# Altium schematic sheet TPS54560_5V.SchDoc
size A4; SheetNumber: 4; SheetTotal: 4
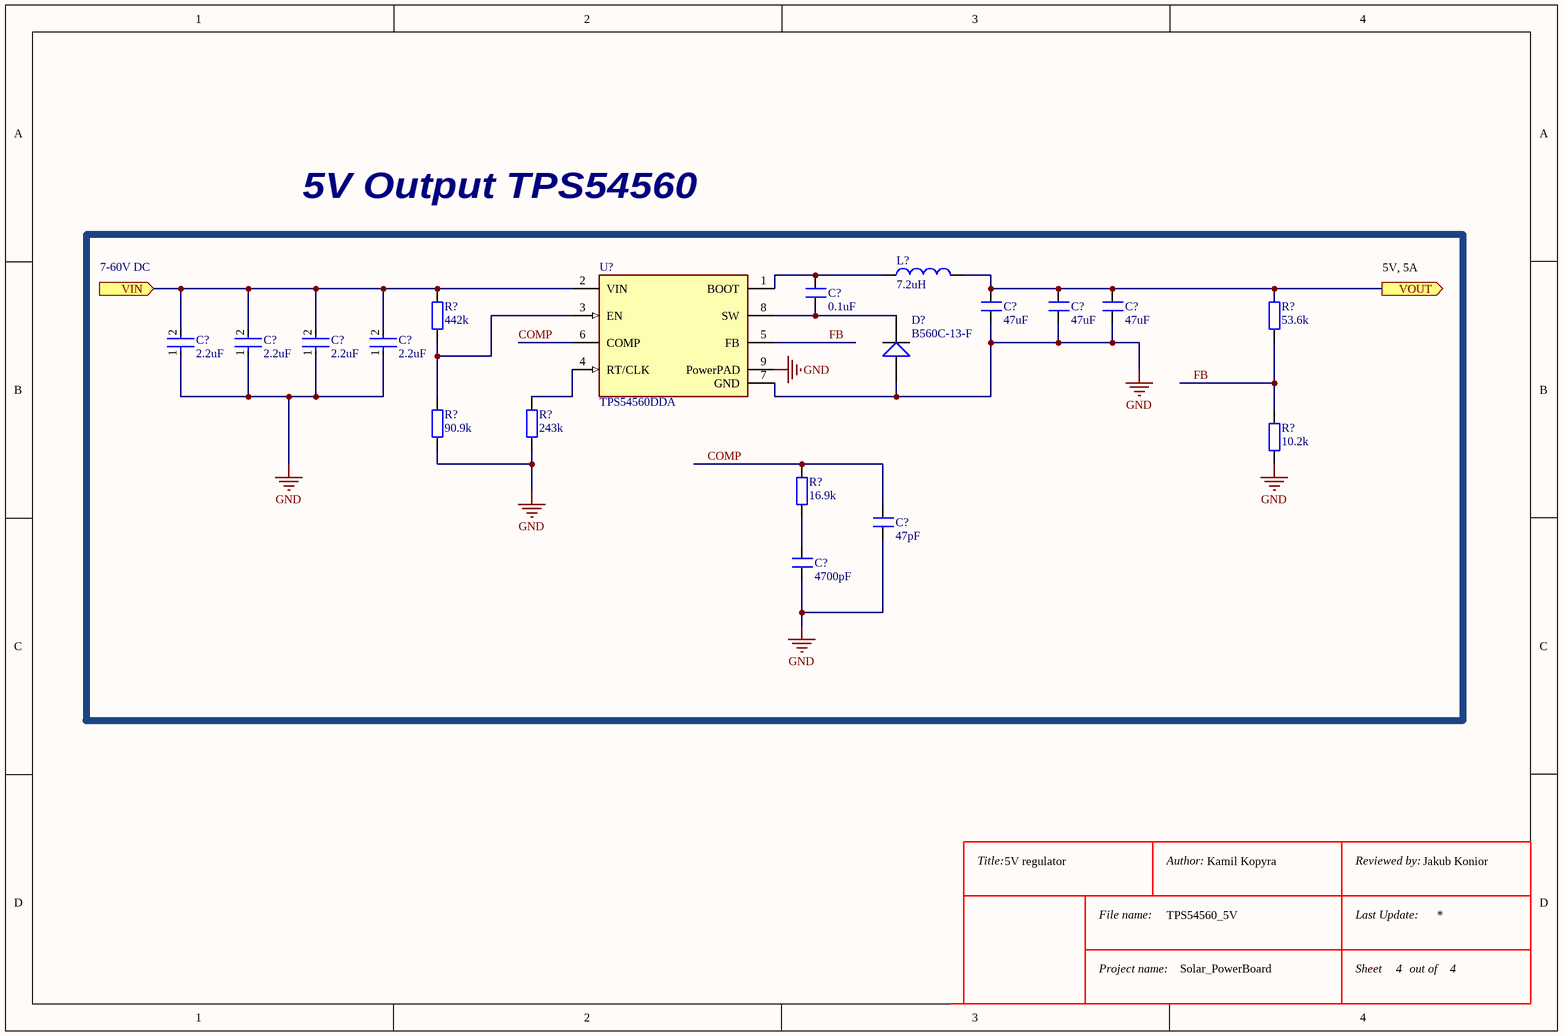
[diagram p0: TPS54560_5V.SchDoc]

## Parts
(Parts that share a designator on the sheet are numbered #1, #2 ... from top to bottom, then left to right.)
C?#1  0.1uF
C?#2  47uF
C?#3  47uF
C?#4  47uF
C?#5  2.2uF  [FP-GRM21B-0_2-e0_2_0_7-IPC_B]
C?#6  2.2uF  [FP-GRM21B-0_2-e0_2_0_7-IPC_B]
C?#7  2.2uF  [FP-GRM21B-0_2-e0_2_0_7-IPC_B]
C?#8  2.2uF  [FP-GRM21B-0_2-e0_2_0_7-IPC_B]
C?#9  47pF
C?#10  4700pF
D?  B560C-13-F
L?  7.2uH
R?#1  442k
R?#2  53.6k
R?#3  90.9k
R?#4  243k
R?#5  10.2k
R?#6  16.9k
U?  TPS54560DDA  [FP-DDA0008E-MFG]

## Blocks framed on the sheet
7-60V DC: C?#1-C?#10 D? L? R?#1-R?#6 U?

## Ports
VIN (in), VOUT (out)

## Nets
GND: C?#2.1 C?#3.1 C?#4.1 C?#5.1 C?#6.1 C?#7.1 C?#8.1 C?#9.1 C?#10.1 D?.6 R?#3.1 R?#4.1 R?#5.1 U?.7(GND) U?.9(PowerPAD)
COMP: C?#9.2 R?#6.2 U?.6(COMP)
FB: R?#2.1 R?#5.2 U?.5(FB)
VIN: C?#5.2 C?#6.2 C?#7.2 C?#8.2 R?#1.2 U?.2(VIN) ; port VIN
VOUT: C?#2.2 C?#3.2 C?#4.2 L?.8 R?#2.2 ; port VOUT
NetC?#1_1: C?#1.1 D?.5 U?.8(SW)
NetC?#1_2: C?#1.2 L?.7 U?.1(BOOT)
NetC?#10_2: C?#10.2 R?#6.1
NetR?#1_1: R?#1.1 R?#3.2 U?.3(EN)
NetR?#4_2: R?#4.2 U?.4(RT/CLK)

## Notes on the sheet
- 5V Output TPS54560
- 5V, 5A
- 5V regulator
- TPS54560_5V
- Kamil Kopyra
- Jakub Konior
- Solar_PowerBoard
- Title:
- File name:
- Author:
- Reviewed by:
- Last Update:
- Project name:
- Sheet
- out of

## Library data of the parts
C?#1-C?#4 C?#9 C?#10 = Capacitor Ceramic
C?#5-C?#8 = CMP-06035-063309-1: CAP CER 2.2UF 100V X7T 0805
D? = Diode
L? = Inductor
R?#1-R?#6 = Resistor
U? = CMP-04918-000033-1: IC REG BCK SPLIT RAIL ADJ 8SOPWR; Manufacturer: Texas Instruments; Min Supply Voltage: 4.5V; Switching Topology: Buck; Max Junction Temp: +150°C; Max Duty Cycle: 100%; Standoff Height: 0mm; Output Type: AdjustableProgrammable; Output Voltage: 0.8-58.8V; Output Current: 5A; Number Of Outputs: 1; Switching Frequency: 100-2500kHz; Max Supply Voltage: 60V; Nominal Supply Current: 146uA; Octopart: https://octopart.com/tps54560dda-texas+instruments-26977150; Temperature: -40°C to +125°C; ComponentLink2Description: Datasheet; Category: IC; Mouser Description: Voltage Regulators - Switching Regulators 60V Input 5 A SD DC-DC Cnvtr; Automotive: No; Ipc Land Pattern Name: SOIC127P600X170-8; Height: 1.7mm; RoHS: TRUE; ComponentLink2URL: http://www.ti.com/lit/ds/symlink/tps54560.pdf; Device Class L3: Voltage Regulators - Switching; Temperature Range High: +125°C; Device Class L2: Power Management ICs; Package: DDA0008E; Lead Free: Yes; Digikey Description: IC REG BCK SPLIT RAIL ADJ 8SOPWR; Device Class L1: Integrated Circuits (ICs); Manufacturer Part Number: TPS54560DDA; Temperature Range Low: -40°C